# Altium schematic sheet RP_AND_SAFETYSW.SchDoc
size B; SheetNumber: 6; SheetTotal: 11
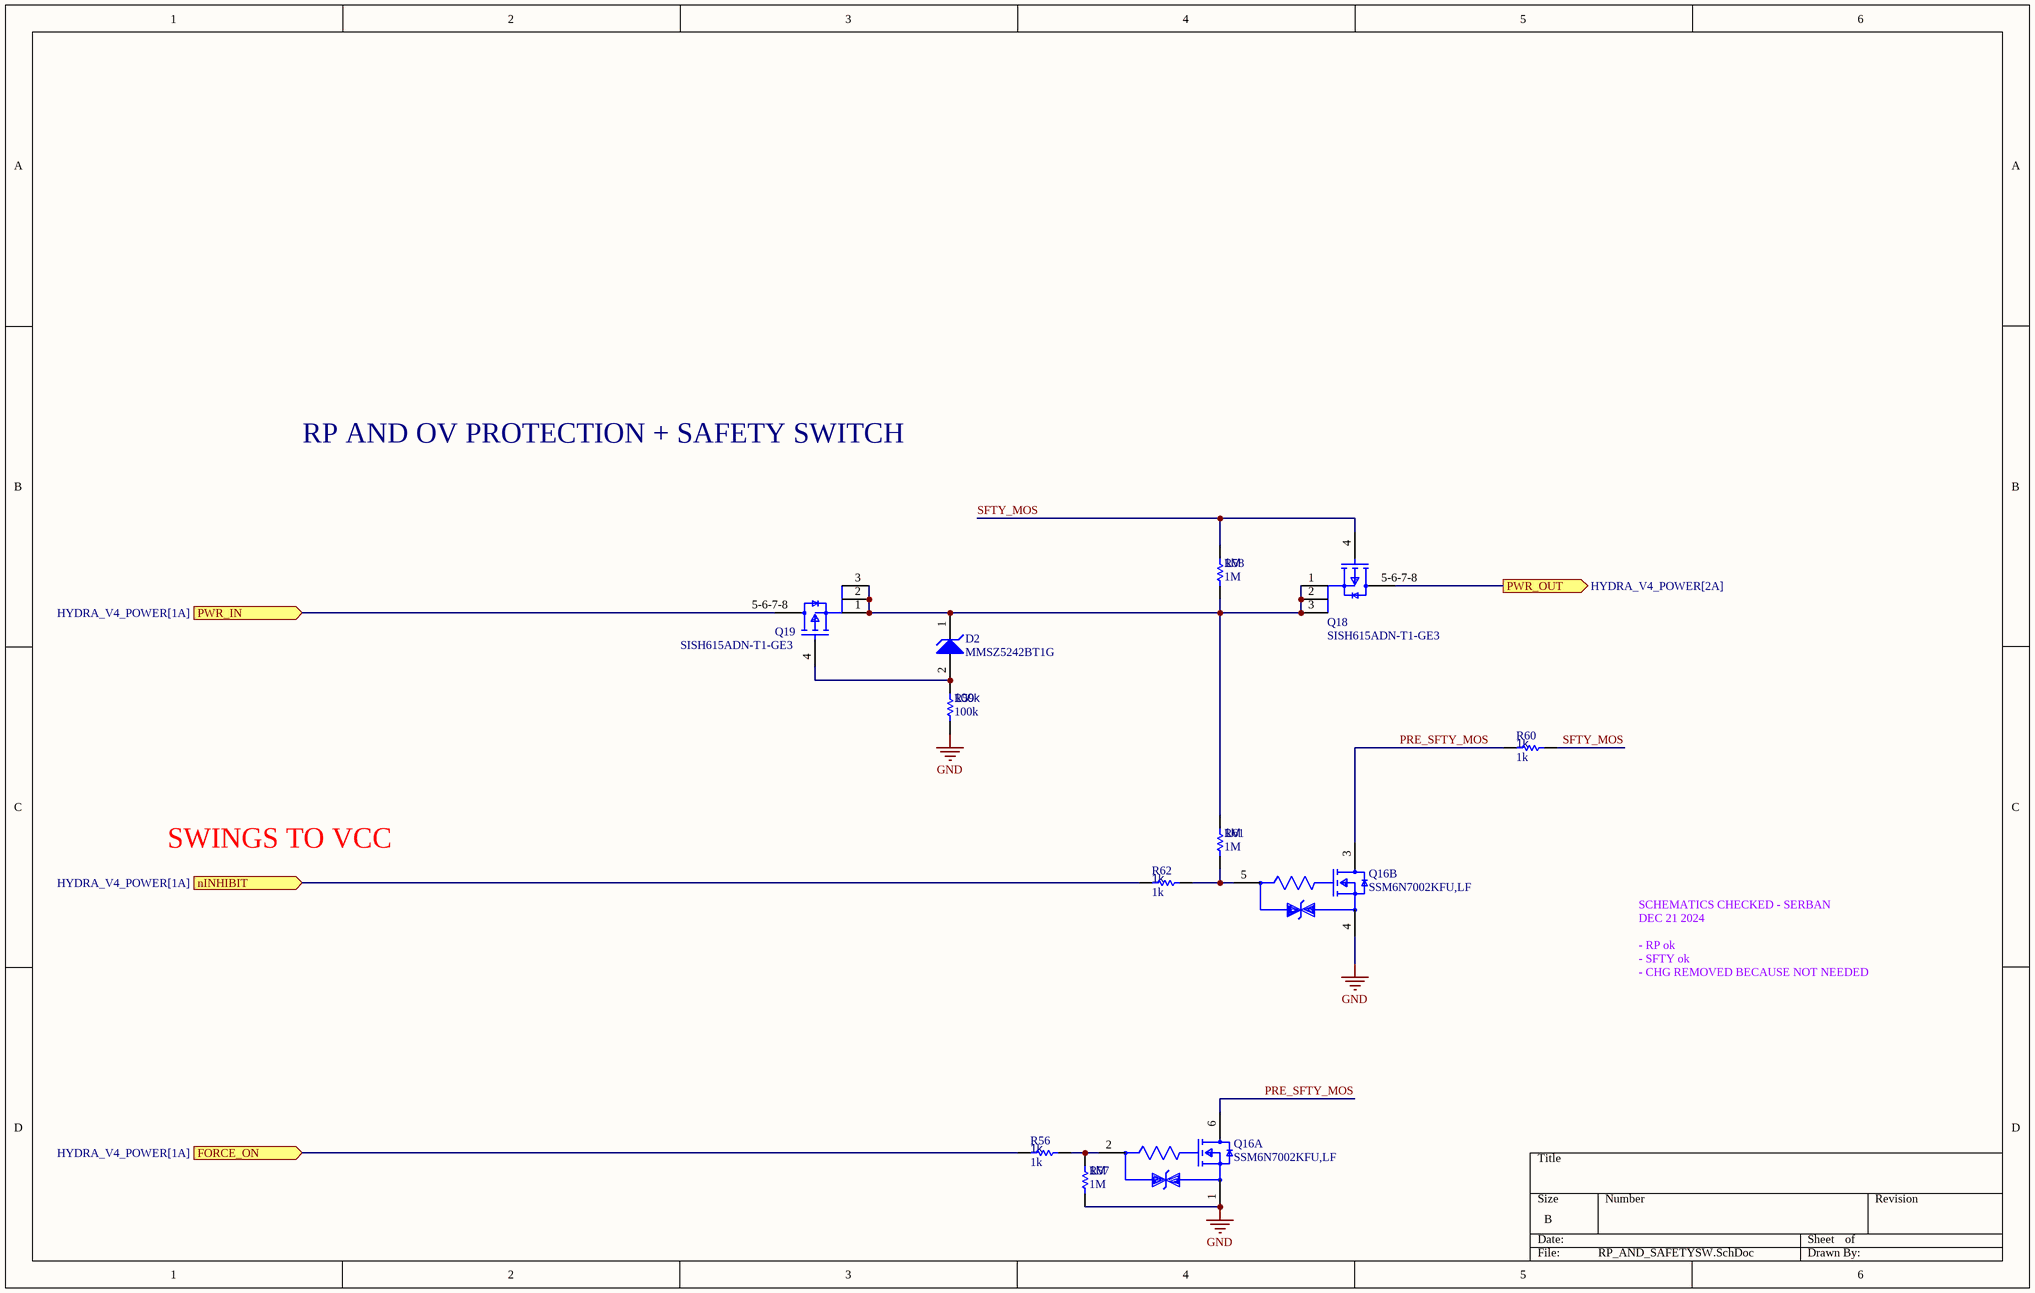
[diagram p0: RP_AND_SAFETYSW.SchDoc]

## Parts
D2  MMSZ5242BT1G  [ONSC-SOD-123-2-425-04_V]
Q16  SSM6N7002KFU,LF  [FP-SSOP6-P-0_65A-MFG]  (parts A,B of 2)
Q18  SISH615ADN-T1-GE3  [SISH615ADN-T1-GE3-Footprint-1]
Q19  SISH615ADN-T1-GE3  [SISH615ADN-T1-GE3-Footprint-1]
R56  1k  [R0603B]
R57  1M  [R0603B]
R58  1M  [R0603B]
R59  100k  [R0603B]
R60  1k  [R0603B]
R61  1M  [R0603B]
R62  1k  [R0603B]

## Ports
FORCE_ON (in, see HYDRA_V4_POWER[1A]), nINHIBIT (in, see HYDRA_V4_POWER[1A]), PWR_IN (in, see HYDRA_V4_POWER[1A]), PWR_OUT (out, see HYDRA_V4_POWER[2A])

## Nets
GND: Q16.1(Source1) Q16.4(Source2) R57.2 R59.1
FORCE_ON: R56.2 ; port FORCE_ON
nINHIBIT: R62.2 ; port nINHIBIT
PRE_SFTY_MOS: Q16.3(Drain2) Q16.6(Drain1) R60.2
PWR_IN: Q19.5-6-7-8(D) ; port PWR_IN
PWR_OUT: Q18.5-6-7-8(D) ; port PWR_OUT
SFTY_MOS: Q18.4(G) R58.2 R60.1
NetD2_1: D2.1(K) Q18.1(S) Q18.2(S) Q18.3(S) Q19.1(S) Q19.2(S) Q19.3(S) R58.1 R61.1
NetD2_2: D2.2(A) Q19.4(G) R59.2
NetQ16_2: Q16.2(Gate1) R56.1 R57.1
NetQ16_5: Q16.5(Gate2) R61.2 R62.1

## Notes on the sheet
- RP AND OV PROTECTION + SAFETY SWITCH
- SWINGS TO VCC
- SCHEMATICS CHECKED - SERBAN
  DEC 21 2024
  - RP ok
  - SFTY ok
  - CHG REMOVED BECAUSE NOT NEEDED

## Library data of the parts
D2 = CMP-1060-00565-1: Zener Voltage Regulator, 500 mW, 2-Pin SOD-123, Pb-Free, Tape and Reel; Manufacturer: On Semiconductor; P Max (W): 0.5; VZ Typ (V): 12; PartNumber: MMSZ5242BT1G; PackageReference: SOD-123-2-425-04; ComponentLink3URL: http://www.onsemi.com/pub_link/Collateral/425-04.PDF; Mounting Technology: Surface Mount; ComponentLink2Description: Datasheet; ComponentLink1URL: http://www.onsemi.com/; ComponentLink3Description: Package Specification; PackageDescription: 2-Pin SOD, Body 1.6 x 2.69 mm; PackageVersion: Rev. G, 10/2009; ComponentLink1Description: Manufacturer URL; RoHS: Pb-Free; ComponentLink2URL: http://www.onsemi.com/pub_link/Collateral/MMSZ5221BT1-D.PDF; Packing: Tape and Reel; DatasheetVersion: Rev. 12
Q16 = CMP-35916-000009-1: MOSFET 2N-CH 60V 0.3A; Input Capacitance: 40pF; Continuous Drain Current (ID): 300mA; Max Power Dissipation: 285mW; FET Type: 2 N-Channel; Rds On Max: 1.5R; Mount: Surface Mount; Drain to Source Voltage (Vdss): 60V; Packaging: Tape and Reel
Q18 Q19 = CMP-013-00018-2: Trans MOSFET P-CH 20V 22.1A 8-Pin PowerPAK 1212 EP T/R; Source: SISH615ADN-T1-GE3.SchLib; Design Item ID: CMP-013-00036-4; Component Type: Standard; Pins: 5
R56-R62 = CMP-009-00002-14: Resistor
  R56 R60 R62: Value: 1k
  R57 R58 R61: Value: 1M
  R59: Value: 100k